# EAGLE design item_2022_analog_02 (EAGLE 9.6.2)
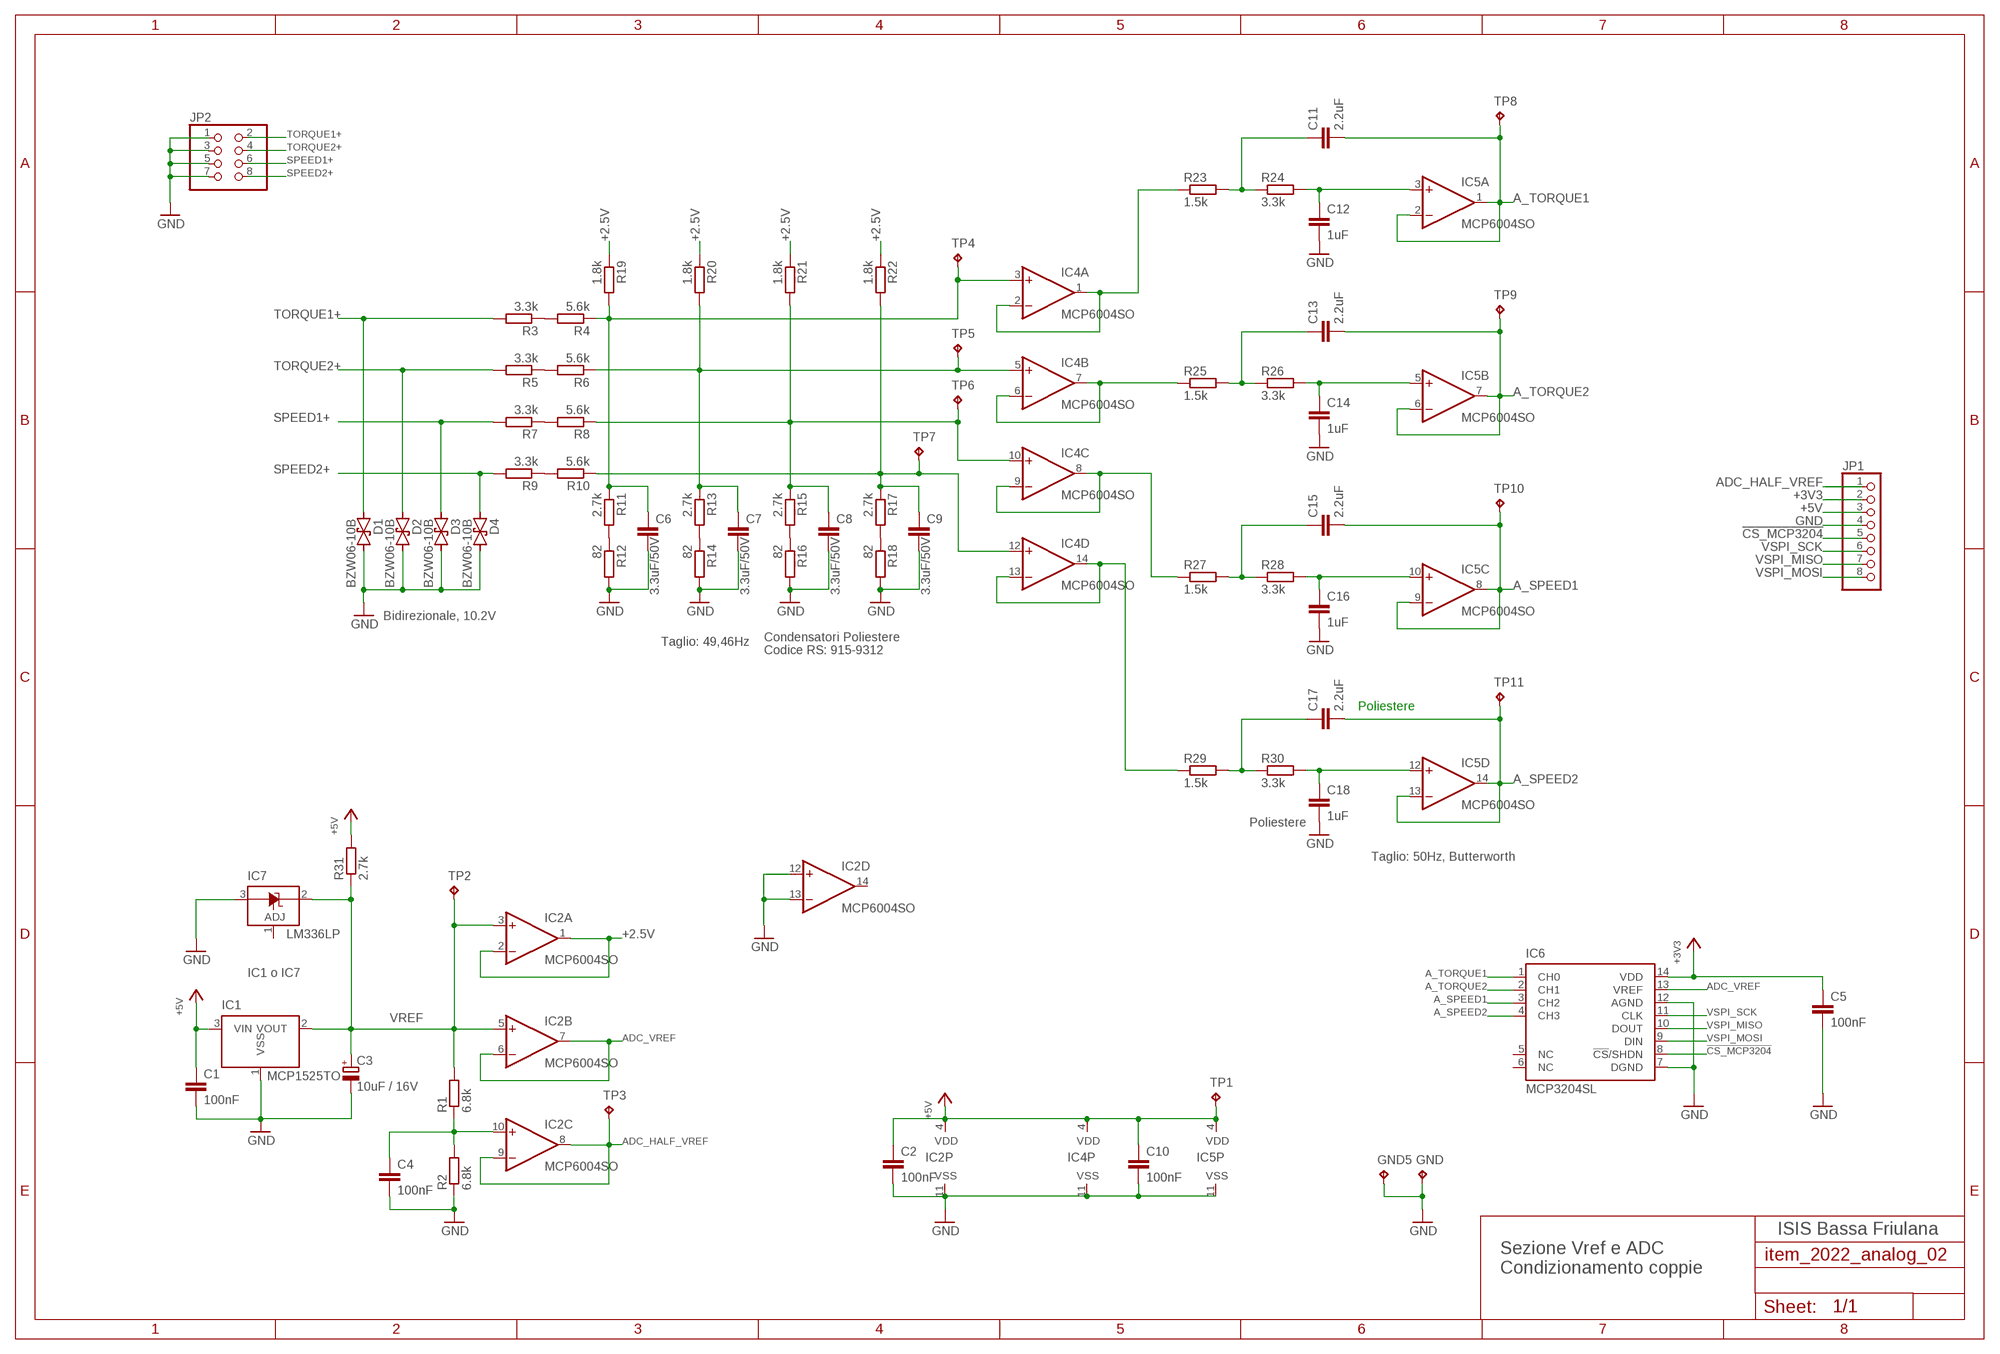
[diagram p0: schematic, sheet 1]

## Parts
C1  100nF  C-EUC0805  [C0805]
C2  100nF  C-EUC0805  [C0805]
C3  10uF / 16V  CPOL-EUC  [PANASONIC_C]
C4  100nF  C-EUC0805  [C0805]
C5  100nF  C-EUC0805  [C0805]
C6  3.3uF/50V  C-EUC0805  [C0805]
C7  3.3uF/50V  C-EUC0805  [C0805]
C8  3.3uF/50V  C-EUC0805  [C0805]
C9  3.3uF/50V  C-EUC0805  [C0805]
C10  100nF  C-EUC0805  [C0805]
C11  2.2uF  C-EUC0805  [C0805]
C12  1uF  C-EUC0805  [C0805]
C13  2.2uF  C-EUC0805  [C0805]
C14  1uF  C-EUC0805  [C0805]
C15  2.2uF  C-EUC0805  [C0805]
C16  1uF  C-EUC0805  [C0805]
C17  2.2uF  C-EUC0805  [C0805]
C18  1uF  C-EUC0805  [C0805]
D1  BZW06-10B  BZW04XXB  [F126Z12]
D2  BZW06-10B  BZW04XXB  [F126Z12]
D3  BZW06-10B  BZW04XXB  [F126Z12]
D4  BZW06-10B  BZW04XXB  [F126Z12]
GND  TPTP18SQ  [TP18SQ]
GND5  TPTP18SQ  [TP18SQ]
IC1  MCP1525TO  [TO92]
IC2  MCP6004SO  [SO14]
IC4  MCP6004SO  [SO14]
IC5  MCP6004SO  [SO14]
IC6  MCP3204SL  [SO14]
IC7  LM336LP  [TO92]
JP1  PINHD-1X8  [1X08]
JP2  PINHD-2X4  [2X04]
R1  6.8k  R-EU_R0805  [R0805]
R2  6.8k  R-EU_R0805  [R0805]
R3  3.3k  R-EU_R0805  [R0805]
R4  5.6k  R-EU_R0805  [R0805]
R5  3.3k  R-EU_R0805  [R0805]
R6  5.6k  R-EU_R0805  [R0805]
R7  3.3k  R-EU_M0805  [M0805]
R8  5.6k  R-EU_R0805  [R0805]
R9  3.3k  R-EU_R0805  [R0805]
R10  5.6k  R-EU_R0805  [R0805]
R11  2.7k  R-EU_R0805  [R0805]
R12  82  R-EU_R0805  [R0805]
R13  2.7k  R-EU_R0805  [R0805]
R14  82  R-EU_R0805  [R0805]
R15  2.7k  R-EU_R0805  [R0805]
R16  82  R-EU_R0805  [R0805]
R17  2.7k  R-EU_R0805  [R0805]
R18  82  R-EU_R0805  [R0805]
R19  1.8k  R-EU_R0805  [R0805]
R20  1.8k  R-EU_R0805  [R0805]
R21  1.8k  R-EU_R0805  [R0805]
R22  1.8k  R-EU_R0805  [R0805]
R23  1.5k  R-EU_R0805  [R0805]
R24  3.3k  R-EU_R0805  [R0805]
R25  1.5k  R-EU_R0805  [R0805]
R26  3.3k  R-EU_R0805  [R0805]
R27  1.5k  R-EU_R0805  [R0805]
R28  3.3k  R-EU_R0805  [R0805]
R29  1.5k  R-EU_R0805  [R0805]
R30  3.3k  R-EU_R0805  [R0805]
R31  2.7k  R-EU_R0805  [R0805]
TP1  TPTP16R  [TP16R]
TP2  TPTP16R  [TP16R]
TP3  TPTP16R  [TP16R]
TP4  TPTP14R  [TP14R]
TP5  TPTP14R  [TP14R]
TP6  TPTP14R  [TP14R]
TP7  TPTP14R  [TP14R]
TP8  TPTP14R  [TP14R]
TP9  TPTP14R  [TP14R]
TP10  TPTP14R  [TP14R]
TP11  TPTP14R  [TP14R]

## Nets
!CS_MCP3204! [digital]: IC6.8(!CS!/SHDN) JP1.5
+2.5V [supply]: IC2.1(A:OUT) IC2.2(A:-IN) R19.1 R20.1 R21.1 R22.1
+3V3 [supply]: C5.1 IC6.14(VDD) JP1.2
+5V [supply]: C1.1 C2.1 C10.1 IC1.3(VIN) IC2.4(P:VDD) IC4.4(P:VDD) IC5.4(P:VDD) JP1.3 R31.2 TP1.TP
A_SPEED1: C15.2 IC5.8(C:OUT) IC5.9(C:-IN) IC6.3(CH2) TP10.TP
A_SPEED2: C17.2 IC5.13(D:-IN) IC5.14(D:OUT) IC6.4(CH3) TP11.TP
A_TORQUE1: C11.2 IC5.1(A:OUT) IC5.2(A:-IN) IC6.1(CH0) TP8.TP
A_TORQUE2: C13.2 IC5.6(B:-IN) IC5.7(B:OUT) IC6.2(CH1) TP9.TP
ADC_HALF_VREF [supply]: IC2.8(C:OUT) IC2.9(C:-IN) JP1.1 TP3.TP
ADC_VREF [supply]: IC2.6(B:-IN) IC2.7(B:OUT) IC6.13(VREF)
GND [supply]: C1.2 C2.2 C3.- C4.2 C5.2 C6.2 C7.2 C8.2 C9.2 C10.2 C12.2 C14.2 C16.2 C18.2 D1.C D2.C D3.C D4.C GND5.TP GND.TP IC1.1(VSS) IC2.11(P:VSS) IC2.12(D:+IN) IC2.13(D:-IN) IC4.11(P:VSS) IC5.11(P:VSS) IC6.7(DGND) IC6.12(AGND) IC7.3(A) JP1.4 JP2.1 JP2.3 JP2.5 JP2.7 R2.1 R12.2 R14.2 R16.2 R18.2
N$3: C4.1 IC2.10(C:+IN) R1.1 R2.2
N$7: R3.1 R4.2
N$8: R5.1 R6.2
N$9: R7.1 R8.2
N$10: R9.1 R10.2
N$11: R11.2 R12.1
N$12: C6.1 IC4.3(A:+IN) R4.1 R11.1 R19.2 TP4.TP
N$13: R13.2 R14.1
N$14: R15.2 R16.1
N$15: R17.2 R18.1
N$16: C7.1 IC4.5(B:+IN) R6.1 R13.1 R20.2 TP5.TP
N$17: C8.1 IC4.10(C:+IN) R8.1 R15.1 R21.2 TP6.TP
N$18: C9.1 IC4.12(D:+IN) R10.1 R17.1 R22.2 TP7.TP
N$19: IC4.1(A:OUT) IC4.2(A:-IN) R23.1
N$20: IC4.6(B:-IN) IC4.7(B:OUT) R25.1
N$21: IC4.8(C:OUT) IC4.9(C:-IN) R27.1
N$22: IC4.13(D:-IN) IC4.14(D:OUT) R29.1
N$23: C11.1 R23.2 R24.1
N$24: C12.1 IC5.3(A:+IN) R24.2
N$26: C13.1 R25.2 R26.1
N$27: C14.1 IC5.5(B:+IN) R26.2
N$29: C15.1 R27.2 R28.1
N$30: C16.1 IC5.10(C:+IN) R28.2
N$32: C17.1 R29.2 R30.1
N$33: C18.1 IC5.12(D:+IN) R30.2
SPEED1+: D3.A JP2.6 R7.2
SPEED2+: D4.A JP2.8 R9.2
TORQUE1+: D1.A JP2.2 R3.2
TORQUE2+: D2.A JP2.4 R5.2
VREF: C3.+ IC1.2(VOUT) IC2.3(A:+IN) IC2.5(B:+IN) IC7.2(C) R1.2 R31.1 TP2.TP
VSPI_MISO [digital]: IC6.10(DOUT) JP1.7
VSPI_MOSI [digital]: IC6.9(DIN) JP1.8
VSPI_SCK [digital]: IC6.11(CLK) JP1.6
Unconnected: IC2.14(D:OUT) IC6.5(NC) IC6.6(NC) IC7.1(ADJ)

## Notes on the sheet
- Bidirezionale, 10.2V
- Taglio: 49,46Hz | Condensatori Poliestere
- Codice RS: 915-9312
- Poliestere
- Poliestere
- Taglio: 50Hz, Butterworth
- IC1 o IC7
- ISIS Bassa Friulana
- Sezione Vref e ADC
  Condizionamento coppie

## Library data of the parts
C1 C2 C4 C5 C10 = rcl_LargePads:C-EU: CAPACITOR, European symbol
C3 = rcl_LargePads:CPOL-EU: POLARIZED CAPACITOR, European symbol
C6-C9 = rcl_LargePads:C-EU: CAPACITOR, European symbol; TME_EU: MKS2B043301H00KSSD
C11 C13 C15 C17 = rcl_LargePads:C-EU: CAPACITOR, European symbol; TME_EU: MKS2B042201F00KSSD
C12 C14 C16 C18 = rcl_LargePads:C-EU: CAPACITOR, European symbol; TME_EU: B32529C0105J189
D1-D4 = diode_LargePads:BZW04XXB: DIODE uni and bidirectional supressor diode
GND GND5 TP1-TP11 = testpad:TP: Test pad
IC1 = MCP1525_MCP1541:MCP1525: MCP1525 - 2.5V Precision Voltage Reference
IC2 IC4 IC5 = MCP6002_MCP6004:MCP6004: MCP6004 - 1 MHz, Low-Power quad Op Amp, Rail-to-Rail Input/Output, Supply Voltage: 1.8V to 6.0V
IC6 = MCP3204_MCP3208:MCP3204: MCP3204 - 2.7V 4-Channel 12-Bit A/D Converters with SPI Serial Interface
IC7 = linear:LM336: 2.5-V INTEGRATED REFERENCE CIRCUITS LM236 Source: http://focus.ti.com/lit/ds/symlink/lm336-2.5.pdf
JP1 = pinhead:PINHD-1X8: PIN HEADER
JP2 = pinhead:PINHD-2X4: PIN HEADER
R1-R30 = rcl_LargePads:R-EU_: RESISTOR, European symbol
R31 = rcl:R-EU_: RESISTOR, European symbol

## Net classes
0 default: width 0.305 mm, drill 0.254 mm, clearance 0.305 mm
1 supply: width 0.406 mm, drill 0.305 mm, clearance 0.356 mm to class 0, clearance 0.356 mm
2 digital: width 0.203 mm, drill 0.254 mm, clearance 0.254 mm to class 0, clearance 0.305 mm to class 1, clearance 0.203 mm

## Board
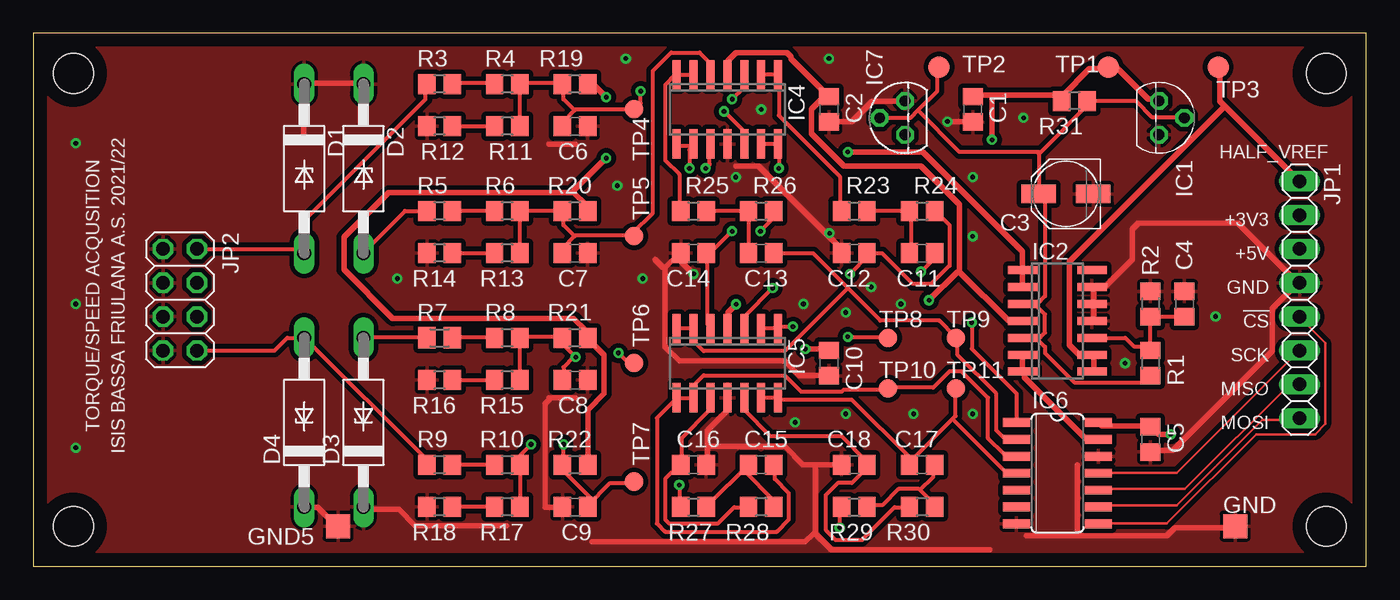
[diagram p1: board, top side]
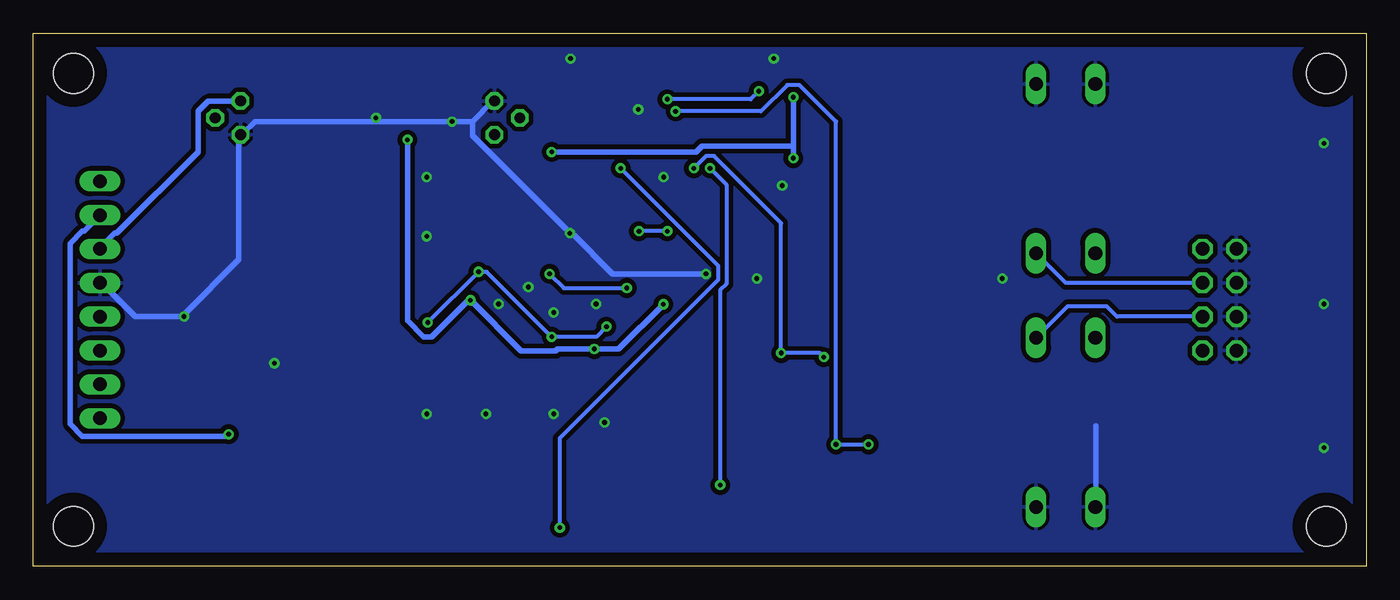
[diagram p2: board, bottom side, seen from below]

Size 100 x 40 mm. Coordinates in mm from the lower left corner, seen from the top.
Outline: 0,0 100,0 100,40 0,40 0,0
Copper layers (1*16): Top 0.035mm / dielectric 1.5mm / Bottom 0.035mm
Design rules "default": minimum track width 6mil, minimum drill 0.35mm, track to track 6mil, track to pad 6mil, pad to pad 6mil, via to via 6mil, smd to smd 6mil, copper to edge 40mil, drill to drill 6mil, minimum pad ring 10mil, minimum via ring 8mil, stop-mask expansion 4mil, vias tented up to drill 0mil, thermal gap 10mil
Holes 3 mm at 3,3 3,37 97,3 97,37

### Footprints (pad centres in the part's own frame; a part is rotated, then mirrored left to right if it is on the bottom)
C0805 = smd 1.3 x 1.5: 1 -0.95,0; 2 0.95,0
PANASONIC_C = smd 2.6 x 1.4: + 2.05,0; - -2.05,0
F126Z12 = drill 1.016 long: A 6.35,0; C -6.35,0
TP18SQ = smd 1.8 x 1.8: TP 0,0
TO92 = drill 0.813 octagon: 1 1.27,0; 2 0,1.905; 3 -1.27,0
SO14 = smd 0.6 x 2.2: 1 -3.81,-2.6; 2 -2.54,-2.6; 3 -1.27,-2.6; 4 0,-2.6; 5 1.27,-2.6; 6 2.54,-2.6; 7 3.81,-2.6; 8 3.81,2.6; 9 2.54,2.6; 10 1.27,2.6; 11 0,2.6; 12 -1.27,2.6; 13 -2.54,2.6; 14 -3.81,2.6
SO14' = smd 0.66 x 2.032: 1 -3.81,-3.073; 2 -2.54,-3.073; 3 -1.27,-3.073; 4 0,-3.073; 5 1.27,-3.073; 6 2.54,-3.073; 7 3.81,-3.073; 8 3.81,3.073; 9 2.54,3.073; 10 1.27,3.073; 11 0,3.073; 12 -1.27,3.073; 13 -2.54,3.073; 14 -3.81,3.073
TO92' = drill 0.813 octagon: 1 -1.27,0; 2 0,1.905; 3 1.27,0
1X08 = drill 1.016 long: 1 -8.89,0; 2 -6.35,0; 3 -3.81,0; 4 -1.27,0; 5 1.27,0; 6 3.81,0; 7 6.35,0; 8 8.89,0
2X04 = drill 1.016 octagon: 1 -3.81,-1.27; 2 -3.81,1.27; 3 -1.27,-1.27; 4 -1.27,1.27; 5 1.27,-1.27; 6 1.27,1.27; 7 3.81,-1.27; 8 3.81,1.27
R0805 = smd 1.3 x 1.5: 1 -0.95,0; 2 0.95,0
M0805 = smd 1.3 x 1.6: 1 -0.95,0; 2 0.95,0
TP16R = smd 1.6 x 1.6: TP 0,0
TP14R = smd 1.4 x 1.4: TP 0,0

### Placement (x,y rotation side)
C1  70.48,34.29 270 top
C2  59.69,34.29 270 top
C3  77.47,27.94 180 top
C4  86.36,19.68 90 top
C5  83.82,9.53 270 top
C6  40.64,33.02 0 top
C7  40.64,23.5 0 top
C8  40.64,13.97 0 top
C9  40.64,4.45 180 top
C10  59.69,15.24 270 top
C11  66.67,23.5 0 top
C12  61.59,23.5 180 top
C13  54.61,23.5 0 top
C14  49.53,23.5 180 top
C15  54.61,7.62 0 top
C16  49.53,7.62 0 top
C17  66.67,7.62 180 top
C18  61.59,7.62 180 top
D1  20.32,29.84 270 top
D2  24.77,29.84 270 top
D3  24.77,10.79 90 top
D4  20.32,10.79 90 top
GND  90.17,3 0 top
GND5  22.86,3 0 top
IC1  84.45,33.66 270 top
IC2  76.83,18.41 270 top
IC4  52.07,34.29 180 top
IC5  52.07,15.24 180 top
IC6  MCP3204SL  [SO14']  76.83,6.99 270 top
IC7  LM336LP  [TO92']  65.41,33.66 90 top
JP1  95,20 270 top
JP2  11,20 270 top
R1  83.82,15.24 270 top
R2  83.82,19.68 270 top
R3  30.48,36.2 180 top
R4  35.56,36.2 180 top
R5  30.48,26.67 180 top
R6  35.56,26.67 180 top
R7  30.48,17.14 180 top
R8  35.56,17.14 180 top
R9  30.48,7.62 180 top
R10  35.56,7.62 180 top
R11  35.56,33.02 180 top
R12  30.48,33.02 180 top
R13  35.56,23.5 180 top
R14  30.48,23.5 180 top
R15  35.56,13.97 180 top
R16  30.48,13.97 180 top
R17  35.56,4.45 180 top
R18  30.48,4.45 180 top
R19  40.64,36.2 180 top
R20  40.64,26.67 180 top
R21  40.64,17.14 180 top
R22  40.64,7.62 180 top
R23  61.59,26.67 0 top
R24  66.67,26.67 0 top
R25  49.53,26.67 0 top
R26  54.61,26.67 0 top
R27  49.53,4.45 0 top
R28  54.61,4.45 180 top
R29  61.59,4.45 0 top
R30  66.67,4.45 180 top
R31  78.11,34.92 180 top
TP1  80.64,37.47 0 top
TP2  67.94,37.47 0 top
TP3  88.9,37.47 0 top
TP4  45.09,34.29 0 top
TP5  45.09,24.77 0 top
TP6  45.09,15.24 0 top
TP7  45.09,6.35 0 top
TP8  64.14,17.14 0 top
TP9  69.22,17.14 0 top
TP10  64.14,13.34 0 top
TP11  69.22,13.34 0 top

### Tracks (layer width: path | path; a pad name or v marks a point on that pad's centre or on a via)
!CS_MCP3204!
  Top 0.203: IC6.8 80.01,3.2 85.04,3.2 91.75,9.91 96.16,9.91 96.93,10.67 96.93,16.76 95.1,18.59 JP1.5
+2.5V  (via drill 0.35)
  Top 0.406: IC2.2 74.22,21.03 74.22,22.1 IC2.1 74.22,22.4 74.22,23.62 66.75,31.09 v61.11,31.09 | R22.1 41.6,7.62 41.6,11.73 42.82,12.95 42.82,15.85 41.6,17.07 R21.1 41.45,17.22 41.45,17.68 40.54,18.59 26.98,18.59 23.32,22.25 23.32,24.69 26.67,28.04 40.54,28.04 | 40.54,28.04 41.45,27.13 41.45,26.67 R20.1 | v42.98,35.2 42.06,36.12 41.6,36.12 R19.1 | v42.98,30.63 40.54,28.19 40.54,28.04
  Bottom 0.406: v42.98,30.63 42.98,31.55 | 42.98,31.55 v42.98,35.2 | v61.11,31.09 50.29,31.09 49.84,31.55 42.98,31.55
+3V3  (via drill 0.35)
  Top 0.406: IC6.14 80.01,10.67 80.16,10.52 83.82,10.52 C5.1 83.97,10.36 84.43,9.91 v85.34,9.91
  Bottom 0.406: v85.34,9.91 85.5,9.75 96.32,9.75 97.23,10.67 97.23,24.23 96.32,25.15 96.16,25.15 95.1,26.21 JP1.2
+5V  (via drill 0.35)
  Top 0.406: 71.93,35.36 77.11,35.36 R31.2 77.27,35.05 77.27,35.36 79.25,37.34 80.62,37.34 TP1.TP 80.77,37.34 81.38,37.34 83.67,35.05 84.43,35.05 IC1.3 | 71.93,35.36 70.56,35.36 C1.1 | v57.91,16.31 59.59,16.31 C10.1 | v52.73,19.66 52.12,19.05 52.12,17.98 IC5.4 | IC4.4 52.12,37.03 52.12,37.95 52.73,38.56 56.54,38.56 56.84,38.25 56.84,38.1 59.59,35.36 C2.1 59.44,35.36 58.37,34.29 58.37,32.46 60.81,30.02 66.6,30.02 69.49,27.13 69.49,22.1 | 69.49,22.1 73.15,18.44 74.22,18.44 IC2.4 | v67.21,19.96 69.34,22.1 69.49,22.1 | v71.93,32 71.93,35.36
  Bottom 0.406: JP1.3 94.94,23.93 93.88,24.99 93.73,24.99 87.63,31.09 87.63,34.14 86.87,34.9 84.58,34.9 IC1.3 | v52.73,19.66 56.08,16.31 v57.91,16.31 60.66,16.31 60.81,16.15 63.4,16.15 v67.21,19.96 67.36,19.96 70.1,17.22 70.71,17.22 71.93,18.44 v71.93,32
A_SPEED1
  Top 0.305: IC6.3 73.76,8.38 72.85,8.38 71.63,9.6 71.63,12.65 69.65,14.63 68.73,14.63 67.51,13.41 64.16,13.41 TP10.TP 64.01,13.26 60.81,13.26 60.66,13.11 57.61,13.11 56.39,14.33 50.29,14.33 49.53,13.56 IC5.9 | C15.2 55.63,7.62 55.63,6.55 56.69,5.49 56.69,3.5 55.78,2.59 47.4,2.59 46.79,3.2 46.79,11.12 48.16,12.5 IC5.8 48.31,12.65 IC5.9 | IC5.9
A_SPEED2
  Top 0.305: IC5.13 54.71,12.65 55.78,12.65 IC5.14 55.93,12.5 61.42,12.5 65.84,8.08 C17.2 65.84,7.62 65.84,7.92 68.96,11.05 | 68.96,11.05 69.19,11.28 69.19,13.26 TP11.TP | 68.96,11.05 73,7.01 73.76,7.01 IC6.4
A_TORQUE1  (via drill 0.35)
  Top 0.305: v61.11,17.22 64.01,17.22 TP8.TP | v57,17.98 55.93,17.98 IC5.1 55.78,17.83 54.71,17.83 IC5.2 | v66.6,22.1 67.51,23.01 67.51,23.47 C11.2 | IC6.1 73.76,12.95 70.41,16.31 v70.41,18.29
  Bottom 0.305: v57,17.98 57.76,17.22 v61.11,17.22 65.99,22.1 v66.6,22.1 v70.41,18.29
A_TORQUE2
  Top 0.305: IC5.6 48.31,17.83 IC5.7 | IC6.2 73.76,9.6 72.85,9.6 72.24,10.21 72.24,12.95 69.34,15.85 69.34,17.07 TP9.TP 69.19,17.22 67.97,18.44 63.55,18.44 61.11,20.88 | 61.11,20.88 58.52,23.47 55.63,23.47 C13.2 | IC5.6 49.53,16.92 50.29,16.15 56.39,16.15 61.11,20.88 | IC5.6
ADC_HALF_VREF
  Top 0.406: IC2.8 79.55,14.63 79.55,15.85 IC2.9 79.25,15.85 78.49,15.85 77.72,16.61 77.72,22.86 89.38,34.52 | 89.38,34.52 94.94,28.96 JP1.1 | 89.38,34.52 89,34.9 89,37.34 TP3.TP
ADC_VREF
  Top 0.406: IC6.13 79.86,9.6 78.94,9.6 74.37,14.17 74.37,14.48 IC2.7 74.22,14.78 74.22,15.85 IC2.6
GND  (via drill 0.35)
  Top 0.406: 23.32,3.05 22.86,3.05 GND5.TP 22.71,3.05 21.34,4.42 20.42,4.42 D4.C | 24.69,4.42 D3.C 24.84,4.27 27.43,4.27 28.65,3.05 35.51,3.05 | 40.69,12.65 38.71,12.65 38.71,12.5 38.41,12.19 38.41,4.42 39.62,4.42 C9.2 39.78,4.27 39.78,3.96 | 41.45,13.41 41.45,13.87 C8.2 | D2.C 24.69,36.27 20.42,36.27 D1.C 20.27,36.12 20.27,32 | 40.69,31.7 38.71,31.7 | 41.45,32.46 41.45,32.92 C6.2 | 50.6,8.99 50.6,10.21 51.97,11.58 51.97,12.5 IC5.11 | 50.6,8.99 50.6,7.62 C16.2 | 58.67,7.62 57.76,7.62 56.39,8.99 50.6,8.99 | 58.67,7.62 C18.2 | 83.82,8.53 C5.2 83.97,8.69 85.5,8.69 92.96,16.15 92.96,19.36 94.79,21.18 JP1.4 94.94,21.18 90.37,25.76 82.91,25.76 82.45,25.3 82.45,23.01 80.31,20.88 79.7,20.88 IC2.13 79.55,20.88 79.55,19.81 IC2.12 79.55,19.66 79.55,18.44 IC2.11 | 74.52,2.29 78.33,2.29 | 78.33,2.29 85.04,2.29 85.65,2.9 90.07,2.9 GND.TP | 73.76,3.05 IC6.7 73.61,3.05 | 78.33,2.29 78.33,7.62 | 58.67,2.44 58.67,7.62 | 58.67,2.44 59.89,1.22 71.78,1.22 | 47.4,22.4 47.4,16.46 48.46,15.39 56.39,15.39 57.45,14.33 59.59,14.33 C10.2 | 47.4,22.4 48.46,23.47 C14.2 48.31,23.16 v49.53,21.95 | 46.63,23.01 47.24,22.4 47.4,22.4 | 59.51,24.92 54.41,30.02 52.73,30.02 | 59.51,24.92 60.5,23.93 60.5,23.62 C12.2 | 52.12,31.55 IC4.11 | C2.2 59.74,33.38 61.42,33.38 62.94,34.9 65.38,34.9 IC7.3 | v68.58,33.38 70.41,33.38 C1.2 | 80.16,28.04 79.55,28.04 C3.- | 84.43,32.31 IC1.1 | 86.23,20.65 C4.2 | v59.74,24.99 59.59,24.99 59.51,24.92 | 41.91,1.83 57.91,1.83 58.52,2.44 58.67,2.44
  Bottom 0.406: 20.27,10.52 20.27,4.57 D4.C | 67.06,33.38 v68.58,33.38 83.36,33.38 84.28,32.46 IC1.1 84.58,32.31 84.58,23.01 88.7,18.9 v88.7,18.75 92.35,18.75 94.94,21.34 JP1.4 | 67.06,33.38 65.53,34.9 IC7.3 | 67.06,33.38 67.06,32.31 v59.74,24.99 59.59,24.99 56.54,21.95 v49.53,21.95
  other vias: 43.81,28.57 70.48,24.77 70.48,29.21 66.04,11.43 81.92,15.24 54.61,34.29 74.3,33.66 57.78,19.68 3.17,31.75 3.17,19.68 3.17,8.89 45.72,21.59 60.96,19.05 57.15,10.79 60.96,11.43 70.48,11.43 62.87,20.95 27.3,21.59 44.45,38.1 59.69,38.1 52.7,29.21 65.09,19.68
  pour Bottom: -1.27,41.91 101.6,41.91 101.6,-1.27 -1.27,-1.27
  pour Top: -1.27,41.91 101.6,41.91 101.6,-1.27 -1.27,-1.27
N$3
  Top 0.305: 79.55,17.22 IC2.10 81.92,17.14 82.55,16.51 83.82,16.51 | R1.1 83.82,16.51 | 83.82,16.51 R2.2 C4.1
N$7
  Top 0.305: R3.1 31.55,36.27 34.59,36.27 R4.2
N$8
  Top 0.305: R6.2 R5.1
N$9
  Top 0.305: R8.2 34.59,17.22 31.55,17.22 R7.1
N$10
  Top 0.305: R10.2 R9.1
N$11
  Top 0.305: R12.1 R11.2
N$12  (via drill 0.35)
  Top 0.305: 36.42,36.12 R4.1 36.58,36.27 | 40.62,34.21 39.78,33.38 39.78,33.07 C6.1 | 40.62,34.21 40.69,34.29 TP4.TP 45.11,34.29 45.57,34.75 v45.57,35.66 | 40.62,34.21 39.78,35.05 39.78,36.12 R19.2 39.62,36.27 36.58,36.27 | IC4.3 53.34,35.97 v52.43,35.05 | R11.1 R4.1 36.58,36.27
  Bottom 0.305: v52.43,35.05 46.18,35.05 v45.57,35.66
N$13
  Top 0.305: R14.1 R13.2
N$14
  Top 0.305: R16.1 R15.2
N$15
  Top 0.305: R17.2 R18.1
N$16
  Top 0.305: 40.62,24.77 40.69,24.84 44.96,24.84 TP5.TP 44.96,24.99 46.48,26.52 46.48,37.19 47.85,38.56 49.99,38.56 50.75,37.8 50.75,37.03 IC4.5 | 40.62,24.77 39.78,25.6 39.78,26.67 R20.2 R6.1 36.42,26.67 36.51,26.58 R13.1 | C7.1 39.69,23.84 40.62,24.77
N$17  (via drill 0.35)
  Top 0.305: TP6.TP 44.65,15.24 v43.89,16 | C8.1 39.78,14.02 39.78,14.94 40.54,15.7 v40.69,15.7 39.78,16.61 39.78,17.07 R21.2 39.62,17.22 36.58,17.22 R8.1 36.42,17.07 36.51,16.98 R15.1 | v50.44,29.87 50.75,30.18 50.75,31.55 IC4.10
  Bottom 0.305: v40.69,15.7 41,16 v43.89,16 43.89,25.76 48.92,30.79 49.53,30.79 v50.44,29.87
N$18  (via drill 0.35)
  Top 0.305: 36.42,7.62 R10.1 | TP7.TP 44.96,6.25 43.28,6.25 41.6,4.57 C9.1 41.91,5.03 39.78,7.16 39.78,7.62 | IC4.12 53.34,32.61 v51.82,34.14 | 39.78,7.62 v39.78,9.14 | 39.78,7.62 R22.2 | v37.34,9.14 36.58,8.38 36.58,7.62 R10.1 | R10.1 R17.1
  Bottom 0.305: v51.82,34.14 45.41,34.14 43.43,36.12 42.52,36.12 39.78,33.38 v39.78,9.14 v37.34,9.14
N$19
  Top 0.305: R23.1 60.5,26.67 60.5,29.26 55.93,33.83 55.93,36.88 IC4.1 55.78,36.88 54.71,36.88 IC4.2
N$20
  Top 0.305: R25.1 48.46,26.67 48.46,29.41 47.4,30.48 47.4,36.12 48.16,36.88 IC4.7 48.31,36.88 IC4.6
N$21  (via drill 0.35)
  Top 0.305: v48.46,6.1 48.46,4.57 R27.1 | v49.23,29.87 49.23,31.24 49.53,31.55 IC4.9 49.38,31.55 48.31,31.55 IC4.8
  Bottom 0.305: v48.46,6.1 48.46,20.73 48.01,21.18 48.01,28.65 v49.23,29.87
N$22  (via drill 0.35)
  Top 0.305: v60.5,2.9 60.5,4.42 R29.1 | v55.93,29.87 55.93,31.55 IC4.14 55.78,31.7 54.71,31.7 IC4.13
  Bottom 0.305: v60.5,2.9 60.5,9.6 48.62,21.49 48.62,22.55 v55.93,29.87
N$23
  Top 0.305: R23.2 R24.1 65.84,26.67 65.84,23.62 C11.1
N$24  (via drill 0.35)
  Top 0.305: R24.2 67.67,26.67 68.73,25.6 68.73,22.55 67.36,21.18 65.99,21.18 63.7,23.47 62.64,23.47 C12.1 62.64,23.32 v61.27,21.95 | IC5.3 53.34,18.75 v55.47,20.88
  Bottom 0.305: v55.47,20.88 60.2,20.88 v61.27,21.95
N$26
  Top 0.305: 53.65,26.67 53.65,23.62 C13.1 | 53.65,26.67 R25.2 | 53.65,26.67 R26.1
N$27  (via drill 0.35)
  Top 0.305: IC5.5 50.75,17.98 50.6,18.14 50.6,23.47 C14.1 50.75,23.47 v52.43,25.15 | v54.56,25.15 55.47,26.06 55.47,26.67 R26.2
  Bottom 0.305: v52.43,25.15 v54.56,25.15
N$29
  Top 0.305: R27.2 50.6,4.57 53.65,7.62 C15.1 53.34,7.16 55.47,5.03 55.47,4.57 R28.1
N$30
  Top 0.305: IC5.10 50.75,12.5 50.75,11.73 48.62,9.6 48.62,7.62 C16.1 48.46,7.62 47.4,6.55 47.4,3.5 47.7,3.2 51.36,3.2 52.58,4.42 53.65,4.42 R28.2
N$32
  Top 0.305: 66.52,5.71 67.67,4.57 R30.1 | 66.52,5.71 66.45,5.79 64.92,5.79 63.7,4.57 62.64,4.57 R29.2 | 66.52,5.71 67.51,6.71 67.51,7.62 C17.1
N$33
  Top 0.305: 62.48,7.62 62.48,7.32 61.42,6.25 60.35,6.25 59.44,5.33 59.44,2.74 60.2,1.98 62.18,1.98 64.62,4.42 65.68,4.42 R30.2 | IC5.12 53.34,11.73 55.32,9.75 60.66,9.75 62.48,7.92 62.48,7.62 | 62.48,7.62 C18.1
SPEED1+
  Top 0.305: R7.2 29.41,17.22 24.84,17.22 D3.A
  Bottom 0.305: D3.A 22.39,19.52 19.49,19.52 18.7,18.73 JP2.6
SPEED2+
  Top 0.305: R9.2 29.41,7.62 29.41,8.08 20.42,17.07 D4.A 20.27,17.07 20.19,17.14 19.05,17.14 18.09,16.19 JP2.8
TORQUE1+
  Top 0.305: 20.42,23.77 20.42,23.62 D1.A 20.39,23.67 | 20.42,23.77 20.42,26.06 29.41,35.05 29.41,36.12 R3.2 | 20.42,23.77 20.39,23.67 | JP2.2 20.25,23.81 20.39,23.67
TORQUE2+
  Top 0.305: R5.2 27.89,26.67 24.84,23.62 D2.A
  Bottom 0.305: 24.69,23.62 D2.A 22.54,21.27 JP2.4
VREF
  Top 0.305: 75.36,16.99 75.29,17.07 74.37,17.07 IC2.5 | 75.36,16.99 75.89,16.46 75.89,16 78.1,13.8 83.33,13.8 R1.2 | 75.36,16.99 75.89,17.53 75.89,18.9 75.13,19.66 74.37,19.66 IC2.3 75.29,19.66 75.89,20.27 75.89,27.43 75.44,27.89 C3.+ 75.44,28.04 75.44,30.94 75.51,31.01 | 66.37,34.21 65.84,33.68 63.55,33.68 IC7.2 | 66.37,34.21 67.82,35.66 67.82,37.34 TP2.TP | IC1.2 86.26,33.68 83.97,33.68 82.75,34.9 79.1,34.9 R31.1 79.1,34.75 79.1,34.59 75.51,31.01 | 66.37,34.21 69.49,31.09 75.44,31.09 75.51,31.01
VSPI_MISO
  Top 0.203: IC6.10 80.01,5.79 86.41,5.79 94.18,13.56 94.94,13.56 JP1.7
VSPI_MOSI
  Top 0.203: IC6.9 80.01,4.57 85.8,4.57 92.2,10.97 94.94,10.97 JP1.8
VSPI_SCK
  Top 0.203: IC6.11 80.01,7.01 85.8,7.01 94.94,16.15 JP1.6

### Text on the board
tNames: HALF_VREF | +3V3 | +5V | GND | TORQUE/SPEED ACQUSITION | ISIS BASSA FRIULANA A.S. 2021/22 | !CS! | SCK | MISO | MOSI